# EAGLE design bigPCB (EAGLE 8.5.0)
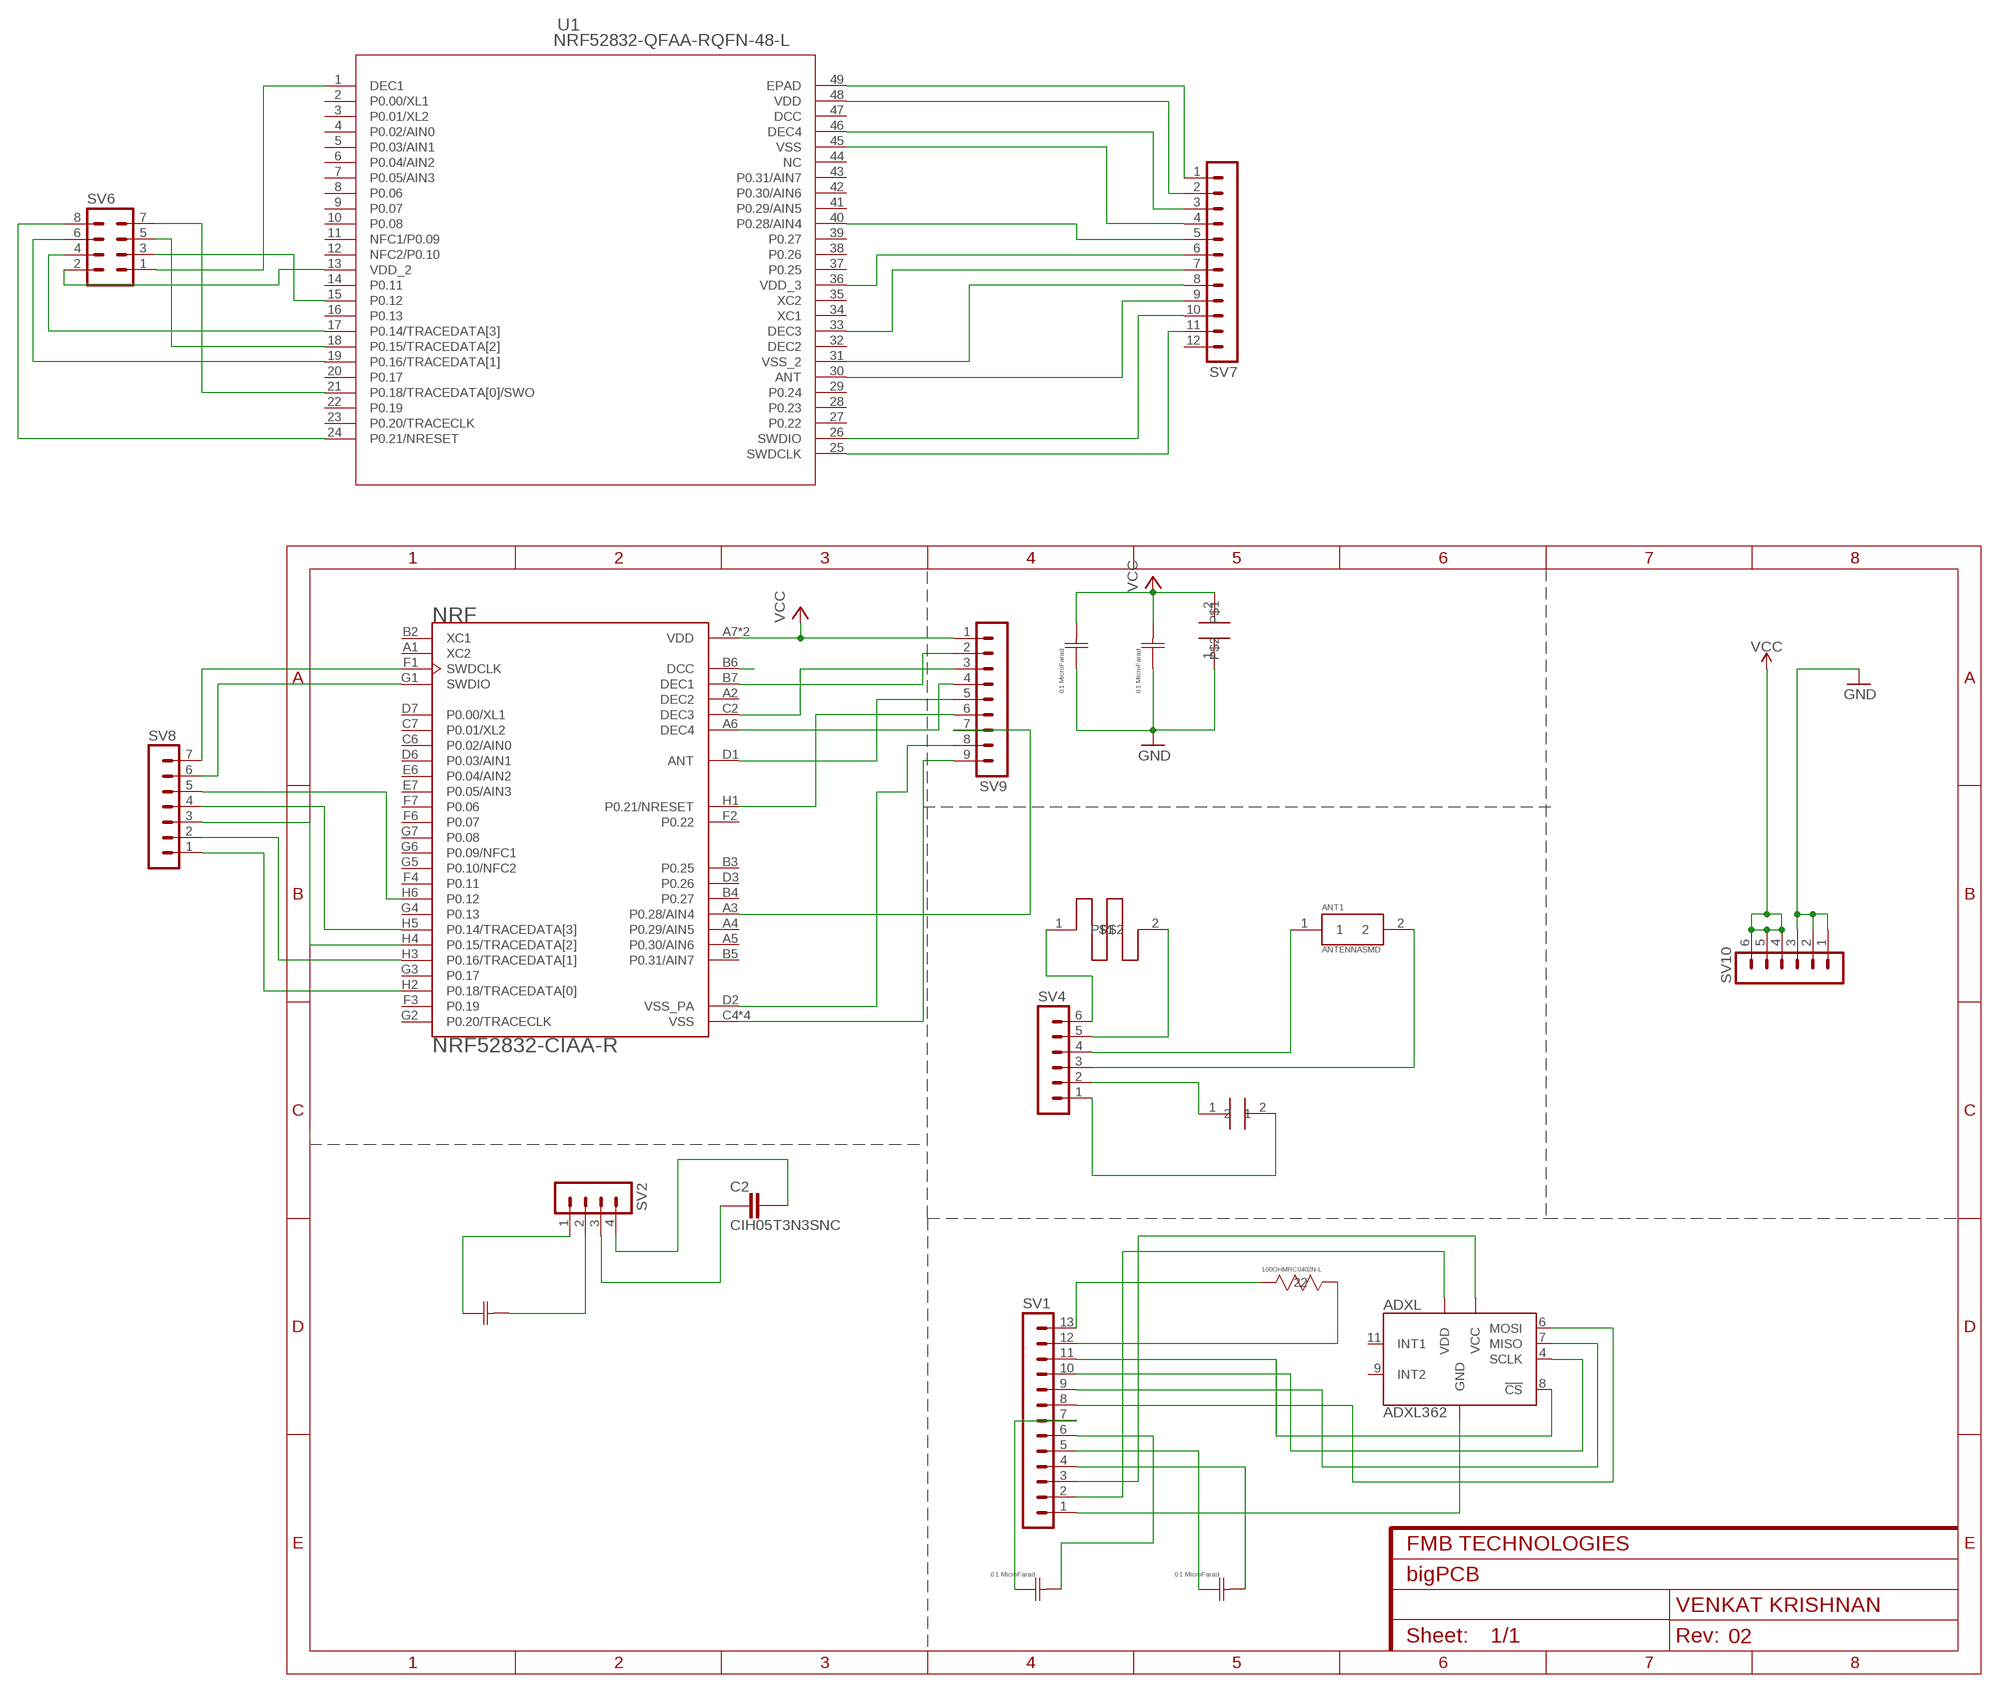
[diagram p0: schematic, sheet 1]

## Parts
ADXL  ADXL362  [TFLGA-16/3.3MMX3.1MM]
ANT1  ANTENNASMD  [1]
C1  GJM1555C1H1R0BB01DG-155-L  [G-155-L]
C2  CIH05T3N3SNC  [CAPC1005X55N]
C6  02016D104KAT2A  [0201]
C7  02016D104KAT2A  [0201]
C8  02016D104KAT2A  [0201]
C9  02016D104KAT2A  [0201]
NRF  NRF52832-CIAA-R  [BGA50N40P7X8_300X320X40]
R6  100OHMRC0402N-L  [RES]
SV1  MA13-1  [MA13-1]
SV2  MA04-1  [MA04-1]
SV4  MA06-1  [MA06-1]
SV6  MA04-2  [MA04-2]
SV7  MA12-1  [MA12-1]
SV8  MA07-1  [MA07-1]
SV9  MA09-1  [MA09-1]
SV10  MA06-1  [MA06-1]
U1  NRF52832-QFAA-RQFN-48-L  [QFN-48-L]
U$1  4.7µF  [CAP]
U$2  0.8PF  [CAP]
U$3  INDUCTOR  [1]

## Nets
GND: C6.1 C7.1 SV10.1 SV10.2 SV10.3 U$1.1
N$1: SV6.1 U1.1(DEC1)
N$2: NRF.B7(DEC1) SV9.2
N$3: R6.1 SV1.13
N$4: R6.2 SV1.12
N$5: SV4.6 U$3.1
N$6: NRF.C2(DEC3) SV9.3
N$7: SV6.3 U1.15(P0.12)
N$8: NRF.A6(DEC4) SV9.4
N$9: NRF.D1(ANT) SV9.5
N$10: ADXL.12(GND) ADXL.13(GND) ADXL.16(GND) SV1.1
N$11: SV6.4 U1.17(P0.14/TRACEDATA[3])
N$12: SV6.5 U1.18(P0.15/TRACEDATA[2])
N$13: SV6.6 U1.19(P0.16/TRACEDATA[1])
N$14: SV6.7 U1.21(P0.18/TRACEDATA[0]/SWO)
N$15: SV6.8 U1.24(P0.21/NRESET)
N$16: SV7.3 U1.46(DEC4)
N$17: SV7.7 U1.33(DEC3)
N$18: NRF.F1(SWDCLK) SV8.7
N$19: NRF.G1(SWDIO) SV8.6
N$20: NRF.H6(P0.12) SV8.5
N$21: NRF.H5(P0.14/TRACEDATA[3]) SV8.4
N$22: NRF.H4(P0.15/TRACEDATA[2]) SV8.3
N$23: NRF.H3(P0.16/TRACEDATA[1]) SV8.2
N$24: NRF.H2(P0.18/TRACEDATA[0]) SV8.1
N$25: SV7.1 U1.49(EPAD)
N$26: NRF.H1(P0.21/NRESET) SV9.6
N$27: SV7.4 U1.45(VSS)
N$28: SV7.5 U1.40(P0.28/AIN4)
N$29: NRF.A3(P0.28/AIN4) SV9.7
N$30: SV7.11 U1.25(SWDCLK)
N$31: SV7.10 U1.26(SWDIO)
N$32: SV7.9 U1.30(ANT)
N$33: SV7.8 U1.31(VSS_2)
N$34: NRF.D2(VSS_PA) SV9.8
N$35: NRF.C4(VSS) NRF.C5(VSS) NRF.E3(VSS) NRF.F5(VSS) SV9.9
N$36: SV4.5 U$3.2
N$37: ANT1.1 SV4.4
N$38: ANT1.2 SV4.3
N$39: SV4.1 U$2.2
N$40: SV4.2 U$2.1
N$41: ADXL.1(VDD) SV1.2
N$42: ADXL.14(VCC) SV1.3
N$43: ADXL.8(!CS) SV1.11
N$44: ADXL.4(SCLK) SV1.10
N$45: ADXL.7(MISO) SV1.9
N$46: ADXL.6(MOSI) SV1.8
N$47: C8.1 SV1.7
N$48: C8.2 SV1.6
N$49: C9.1 SV1.5
N$50: C9.2 SV1.4
N$51: NRF.B6(DCC)
N$61: C1.1 SV2.1
N$62: C1.2 SV2.2
N$63: C2.1 SV2.3
N$64: C2.2 SV2.4
VCC: C6.2 C7.2 NRF.A7(VDD) NRF.H7(VDD) SV6.2 SV7.2 SV7.6 SV9.1 SV10.4 SV10.5 SV10.6 U1.13(VDD_2) U1.36(VDD_3) U1.48(VDD) U$1.2
Unconnected: ADXL.9(INT2) ADXL.11(INT1) NRF.A1(XC2) NRF.A4(P0.29/AIN5) NRF.A5(P0.30/AIN6) NRF.B2(XC1) NRF.B3(P0.25) NRF.B4(P0.27) NRF.B5(P0.31/AIN7) NRF.C6(P0.02/AIN0) NRF.C7(P0.01/XL2) NRF.D3(P0.26) NRF.D6(P0.03/AIN1) NRF.D7(P0.00/XL1) NRF.E6(P0.04/AIN2) NRF.E7(P0.05/AIN3) NRF.F2(P0.22) NRF.F3(P0.19) NRF.F4(P0.11) NRF.F6(P0.07) NRF.F7(P0.06) NRF.G2(P0.20/TRACECLK) NRF.G3(P0.17) NRF.G4(P0.13) NRF.G5(P0.10/NFC2) NRF.G6(P0.09/NFC1) NRF.G7(P0.08) SV7.12 U1.2(P0.00/XL1) U1.3(P0.01/XL2) U1.4(P0.02/AIN0) U1.5(P0.03/AIN1) U1.6(P0.04/AIN2) U1.7(P0.05/AIN3) U1.8(P0.06) U1.9(P0.07) U1.10(P0.08) U1.11(NFC1/P0.09) U1.12(NFC2/P0.10) U1.14(P0.11) U1.16(P0.13) U1.20(P0.17) U1.22(P0.19) U1.23(P0.20/TRACECLK) U1.27(P0.22) U1.28(P0.23) U1.29(P0.24) U1.34(XC1) U1.35(XC2) U1.37(P0.25) U1.38(P0.26) U1.39(P0.27) U1.41(P0.29/AIN5) U1.42(P0.30/AIN6) U1.43(P0.31/AIN7) U1.44(NC)

## Power pins joined to a net without a drawn wire
DCC: U1.47(DCC)
DEC2: NRF.A2(DEC2) U1.32(DEC2)

## Library data of the parts
ADXL = ADXL362:ADXL362: IC ACCEL DIG LO PWR 3AX 16LGA; AVAILABILITY: Good; DESCRIPTION: Accelerometer Triple ±2/±4/±8g 1.6V to 3.6V 16-Pin LGA T/R; MF: Analog Devices; MP: ADXL362BCCZ-RL7; PACKAGE: LGA-16 Analog Devices; PRICE: 6.52 USD
ANT1 = antenna:ANTENNA; AVAILABILITY: Good; DESCRIPTION: Bluetooth/WLAN/WiFi Ceramic Chip Antenna 3-Pin SMD; MF: Pulse; MP: W3008; PACKAGE: None; PRICE: 0.93 USD
C1 = 1pfcap:GJM1555C1H1R0BB01D; MANUFACTURER_PART_NUMBER: GJM1555C1H1R0BB01D; VENDOR: Murata
C2 = 3.3nh_inductor:CIH05T3N3SNC: FIXED IND 3.3NH 300MA 190 MOHM; AVAILABILITY: Good; DESCRIPTION: Ind High Frequency Chip Multi-Layer 3.3nH 0.3nH 100MHz 8Q-Factor Ceramic 300mA 0402 Paper T/R; MF: Samsung; MP: CIH05T3N3SNC; PACKAGE: 0402 Samsung; PRICE: 0.01 USD
C6-C9 = cap_1microfarad:02016D104KAT2A; MANUFACTURER_PART_NUMBER: 02016D104KAT2A; VENDOR: AVX Corporation
NRF = NRF52832-CIAA-R:NRF52832-CIAA-R: Multi Protocal Bluetooth Smart ANT 2.4GHz RF SoC (WL-CSP); AVAILABILITY: Good; DESCRIPTION: Multi Protocal Bluetooth Smart ANT 2.4GHz RF SoC (WL-CSP); MF: Nordic; MP: NRF52832-CIAA-R; PACKAGE: XFBGA-50 Nordic Semiconductor; PRICE: 3.75 USD
R6 = 100ohm:100OHM; MANUFACTURER_PART_NUMBER: RC0402FR07100RL; VENDOR: Yageo
SV1 = con-lstb:MA13-1: PIN HEADER; OC_FARNELL: unknown; OC_NEWARK: unknown
SV2 = con-lstb:MA04-1: PIN HEADER; OC_FARNELL: unknown; OC_NEWARK: unknown
SV4 SV10 = con-lstb:MA06-1: PIN HEADER; OC_FARNELL: unknown; OC_NEWARK: unknown
SV6 = con-lstb:MA04-2: PIN HEADER; OC_FARNELL: unknown; OC_NEWARK: unknown
SV7 = con-lstb:MA12-1: PIN HEADER; OC_FARNELL: unknown; OC_NEWARK: unknown
SV8 = con-lstb:MA07-1: PIN HEADER; OC_FARNELL: unknown; OC_NEWARK: unknown
SV9 = con-lstb:MA09-1: PIN HEADER; OC_FARNELL: unknown; OC_NEWARK: unknown
U1 = NRF52832_QFN:NRF52832-QFAA-R; MANUFACTURER_PART_NUMBER: NRF52832QFAAR; VENDOR: Nordic Semiconductor
U$1 = 4p7microfarad:4.7µF
U$2 = 0p8picofarad:0.8PF
U$3 = inductor:INDUCTOR

## Board
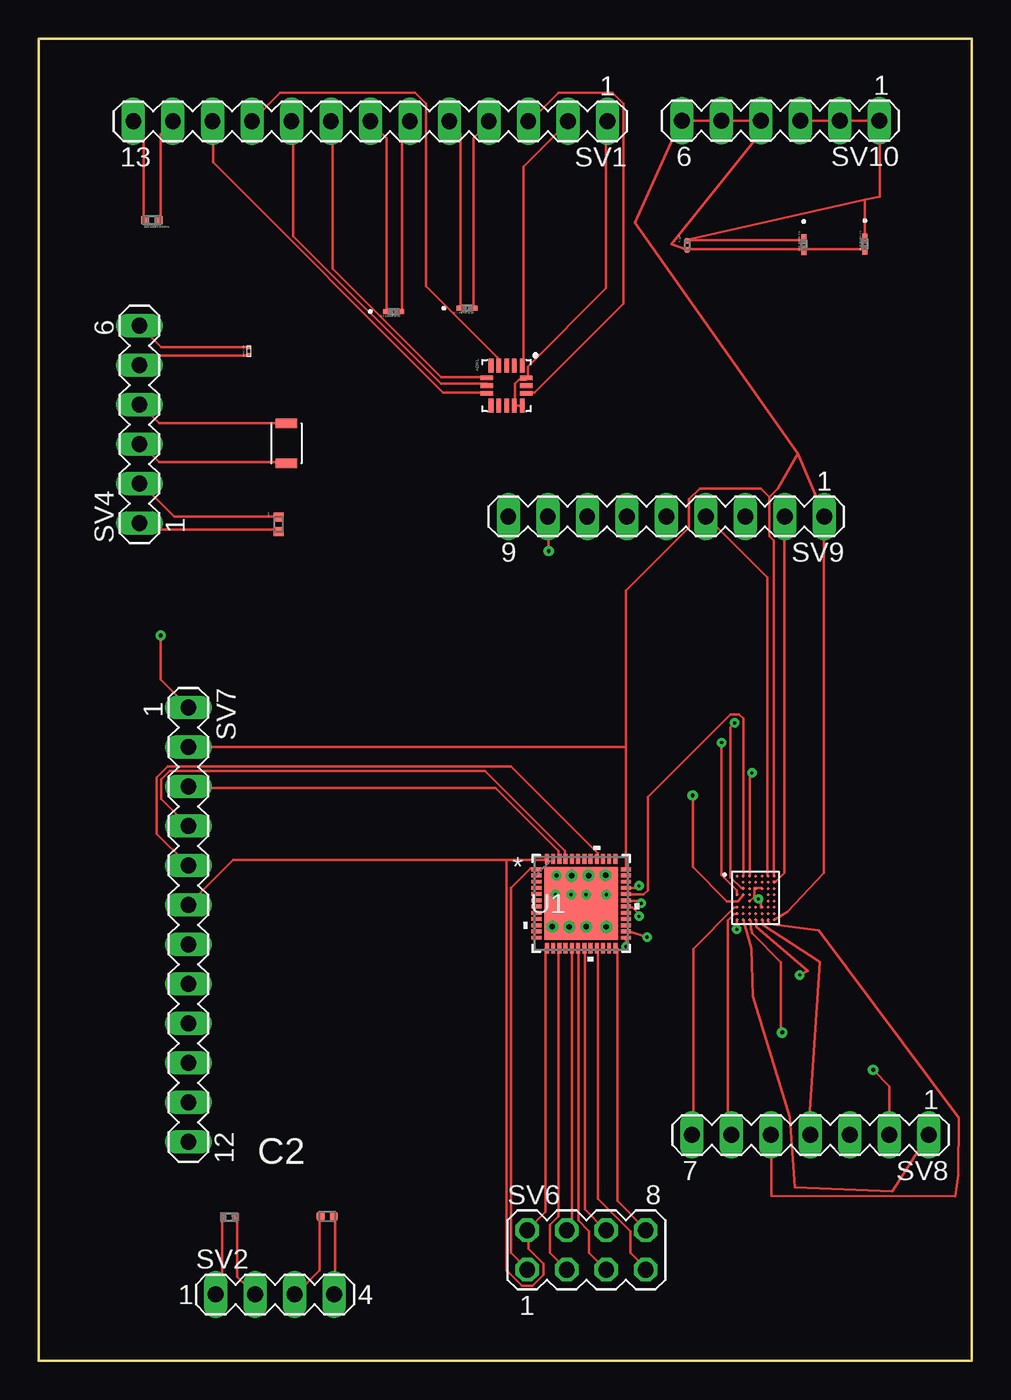
[diagram p1: board, top side]
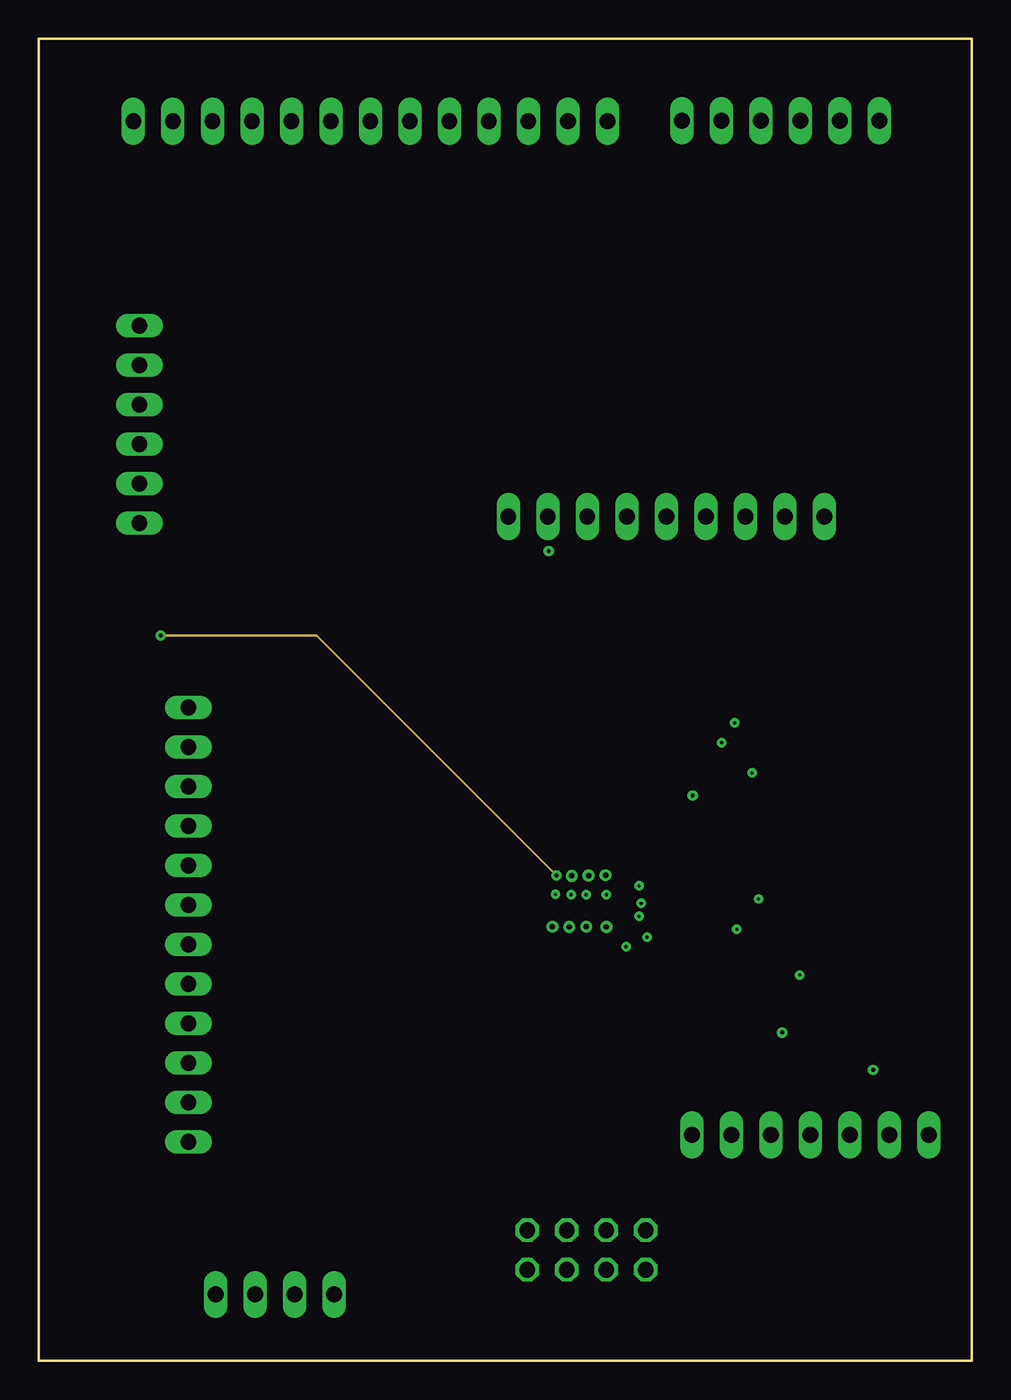
[diagram p2: board, inner layer Route4]
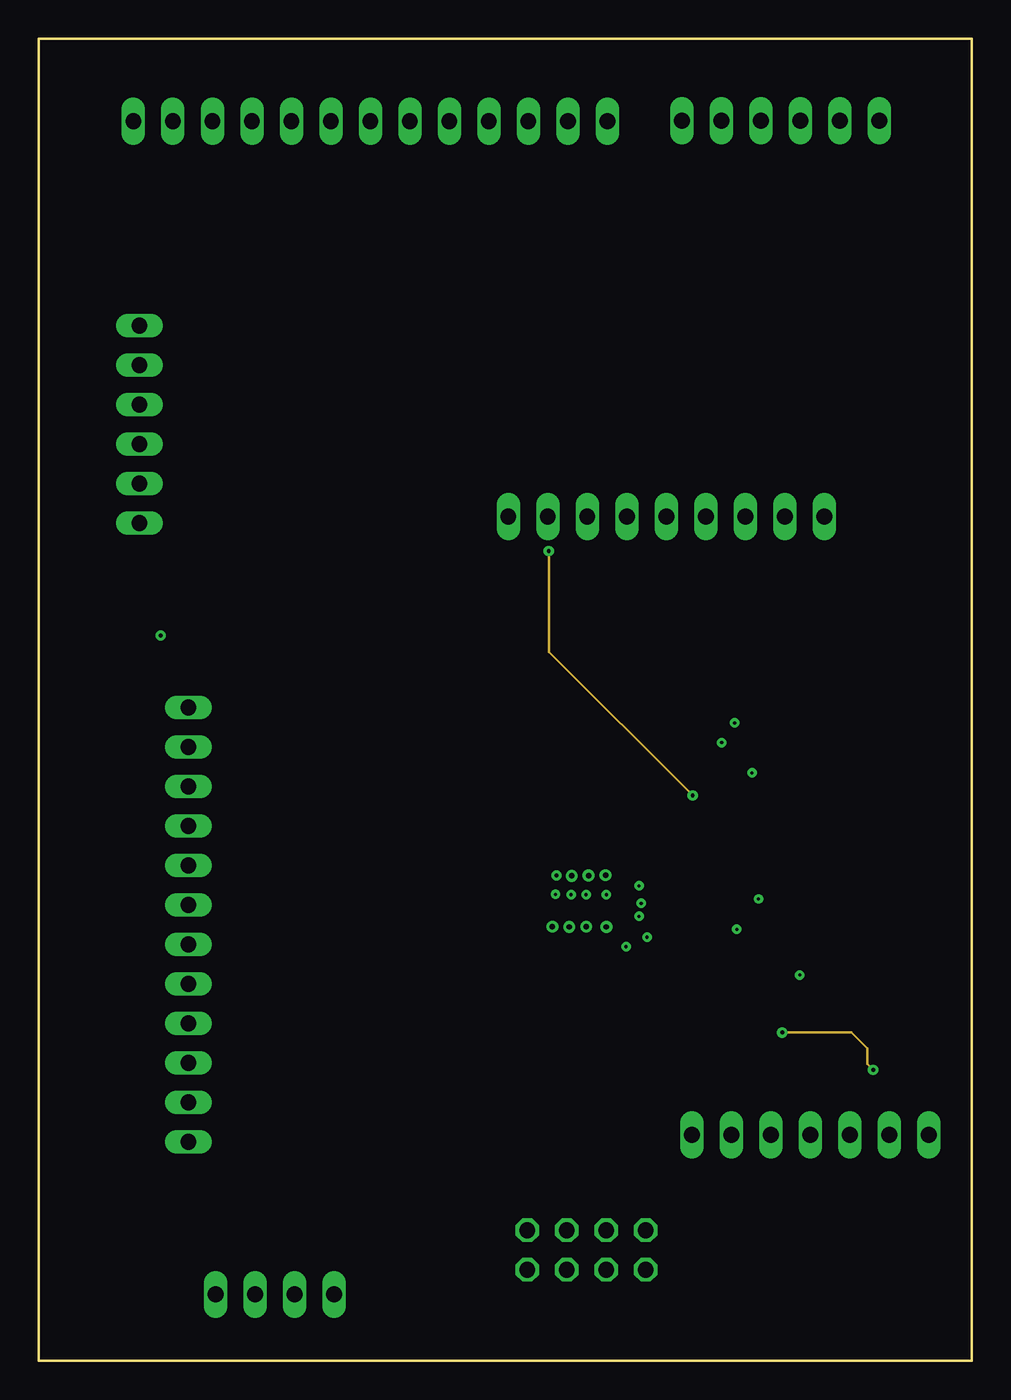
[diagram p3: board, inner layer Route12]
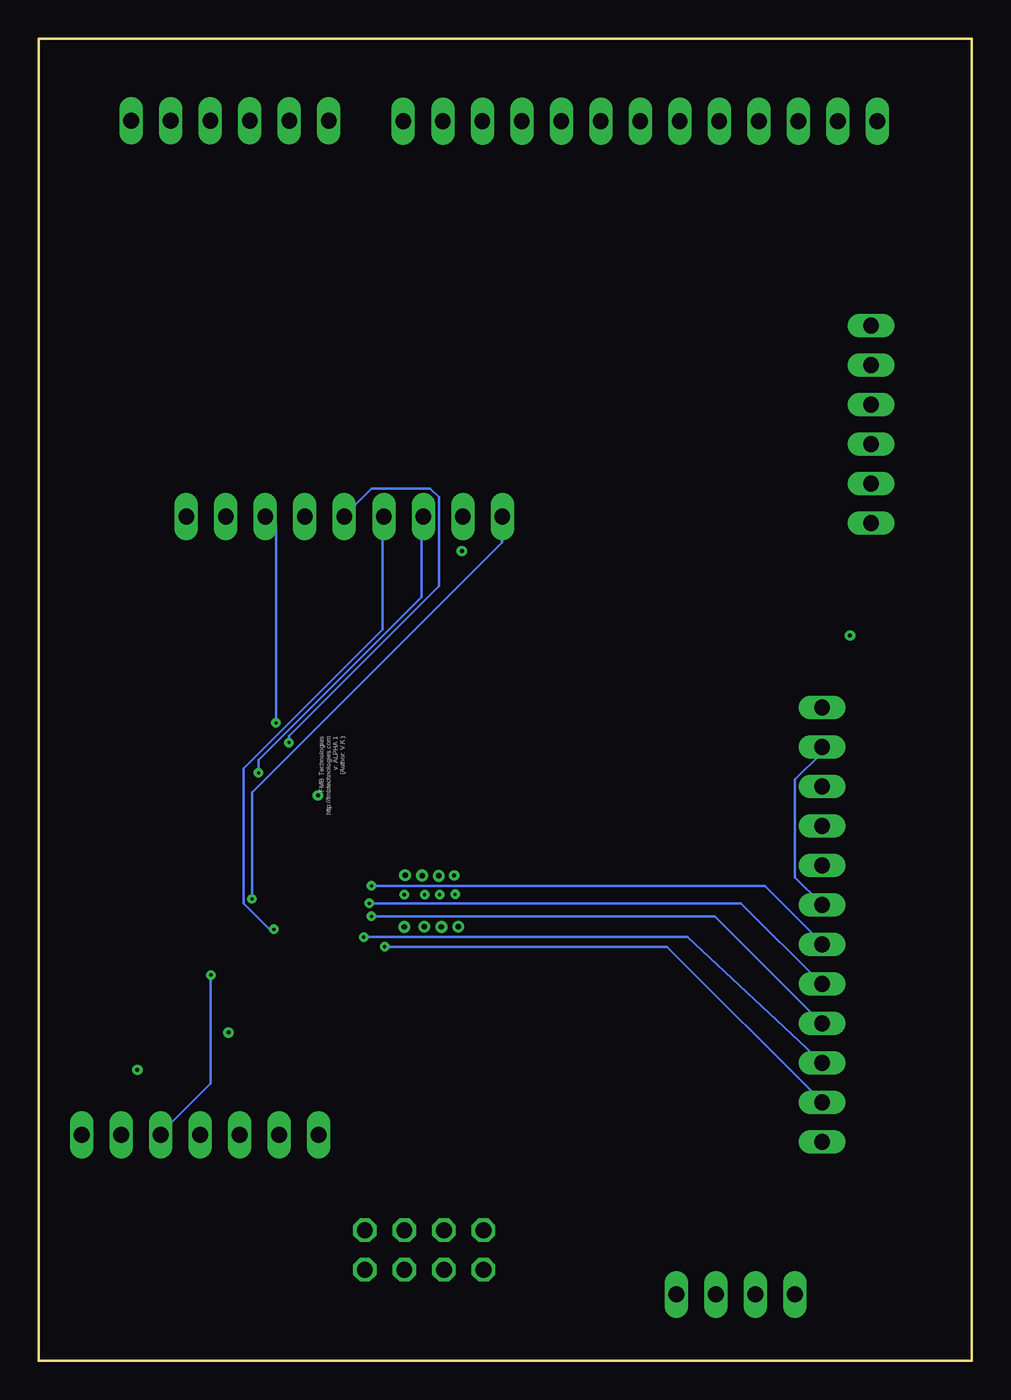
[diagram p4: board, bottom side, seen from below]

Size 60 x 85 mm. Coordinates in mm from the lower left corner, seen from the top.
Outline: 0,85 60,85 60,0 0,0 0,85
Copper layers ((1*4)*(12*16)): Top 0.035mm / dielectric 1.15mm / Route4 0.035mm / dielectric 0.15mm / Route12 0.035mm / dielectric 0.2mm / Bottom 0.035mm
Design rules "default *": minimum track width 6mil, minimum drill 8mil, track to track 5mil, track to pad 5mil, pad to pad 5mil, via to via 5mil, smd to smd 2mil, copper to edge 20mil, drill to drill 20mil, minimum pad ring 10mil, minimum via ring 8mil, stop-mask expansion 4mil, vias tented up to drill 0mil, thermal gap 10mil

### Footprints (pad centres in the part's own frame; a part is rotated, then mirrored left to right if it is on the bottom)
TFLGA-16/3.3MMX3.1MM = smd 0.925 x 0.3: 1 -1.288,1; 2 -1.288,0.5; 3 -1.288,0; 4 -1.288,-0.5; 5 -1.288,-1; 9 1.288,-1; 10 1.288,-0.5; 11 1.288,0; 12 1.288,0.5; 13 1.288,1 | smd 0.3 x 0.8: 6 -0.5,-1.275; 7 0,-1.275; 8 0.5,-1.275; 14 0.5,1.275; 15 0,1.275; 16 -0.5,1.275
1 = smd 0.62 x 1.36: 1 0,0; 2 2.58,0
G-155-L = smd 0.356 x 0.508: 1 -0.419,0; 2 0.419,0
CAPC1005X55N = smd 0.54 x 0.6: 1 -0.43,0; 2 0.43,0
0201 = smd 0.559 x 0.305: 1 -0.394,0; 2 0.394,0
BGA50N40P7X8_300X320X40 = smd 0.2 x 0.2: A1 -1.2,1.4; A2 -0.8,1.4; A3 -0.4,1.4; A4 0,1.4; A5 0.4,1.4; A6 0.8,1.4; A7 1.2,1.4; B2 -0.8,1; B3 -0.4,1; B4 0,1; B5 0.4,1; B6 0.8,1; B7 1.2,1; C2 -0.8,0.6; C3 -0.4,0.6; C4 0,0.6; C5 0.4,0.6; C6 0.8,0.6; C7 1.2,0.6; D1 -1.2,0.2; D2 -0.8,0.2; D3 -0.4,0.2; D6 0.8,0.2; D7 1.2,0.2; E3 -0.4,-0.2; E6 0.8,-0.2; E7 1.2,-0.2; F1 -1.2,-0.6; F2 -0.8,-0.6; F3 -0.4,-0.6; F4 0,-0.6; F5 0.4,-0.6; F6 0.8,-0.6; F7 1.2,-0.6; G1 -1.2,-1; G2 -0.8,-1; G3 -0.4,-1; G4 0,-1; G5 0.4,-1; G6 0.8,-1; G7 1.2,-1; H1 -1.2,-1.4; H2 -0.8,-1.4; H3 -0.4,-1.4; H4 0,-1.4; H5 0.4,-1.4; H6 0.8,-1.4; H7 1.2,-1.4
RES = smd 0.457 x 0.508: 1 -0.457,0; 2 0.457,0
MA13-1 = drill 1.016 long: 1 -15.24,0; 2 -12.7,0; 3 -10.16,0; 4 -7.62,0; 5 -5.08,0; 6 -2.54,0; 7 0,0; 8 2.54,0; 9 5.08,0; 10 7.62,0; 11 10.16,0; 12 12.7,0; 13 15.24,0
MA04-1 = drill 1.016 long: 1 -3.81,0; 2 -1.27,0; 3 1.27,0; 4 3.81,0
MA06-1 = drill 1.016 long: 1 -6.35,0; 2 -3.81,0; 3 -1.27,0; 4 1.27,0; 5 3.81,0; 6 6.35,0
MA04-2 = drill 1.016 octagon: 1 -3.81,-1.27; 2 -3.81,1.27; 3 -1.27,-1.27; 4 -1.27,1.27; 5 1.27,-1.27; 6 1.27,1.27; 7 3.81,-1.27; 8 3.81,1.27
MA12-1 = drill 1.016 long: 1 -13.97,0; 2 -11.43,0; 3 -8.89,0; 4 -6.35,0; 5 -3.81,0; 6 -1.27,0; 7 1.27,0; 8 3.81,0; 9 6.35,0; 10 8.89,0; 11 11.43,0; 12 13.97,0
MA07-1 = drill 1.016 long: 1 -7.62,0; 2 -5.08,0; 3 -2.54,0; 4 0,0; 5 2.54,0; 6 5.08,0; 7 7.62,0
MA09-1 = drill 1.016 long: 1 -10.16,0; 2 -7.62,0; 3 -5.08,0; 4 -2.54,0; 5 0,0; 6 2.54,0; 7 5.08,0; 8 7.62,0; 9 10.16,0
QFN-48-L = smd 0.66 x 0.254: 1 -2.87,2.2; 2 -2.87,1.8; 3 -2.87,1.4; 4 -2.87,1; 5 -2.87,0.6; 6 -2.87,0.2; 7 -2.87,-0.2; 8 -2.87,-0.6; 9 -2.87,-1; 10 -2.87,-1.4; 11 -2.87,-1.8; 12 -2.87,-2.2; 25 2.87,-2.2; 26 2.87,-1.8; 27 2.87,-1.4; 28 2.87,-1; 29 2.87,-0.6; 30 2.87,-0.2; 31 2.87,0.2; 32 2.87,0.6; 33 2.87,1; 34 2.87,1.4; 35 2.87,1.8; 36 2.87,2.2 | smd 0.254 x 0.66: 13 -2.2,-2.87; 14 -1.8,-2.87; 15 -1.4,-2.87; 16 -1,-2.87; 17 -0.6,-2.87; 18 -0.2,-2.87; 19 0.2,-2.87; 20 0.6,-2.87; 21 1,-2.87; 22 1.4,-2.87; 23 1.8,-2.87; 24 2.2,-2.87; 37 2.2,2.87; 38 1.8,2.87; 39 1.4,2.87; 40 1,2.87; 41 0.6,2.87; 42 0.2,2.87; 43 -0.2,2.87; 44 -0.6,2.87; 45 -1,2.87; 46 -1.4,2.87; 47 -1.8,2.87; 48 -2.2,2.87 | smd 4.699 x 4.699: 49 0,0
CAP = smd 0.34 x 0.36: 1 -0.28,0; 2 0.28,0
CAP' = smd 0.58 x 0.62: 1 -0.47,0; 2 0.47,0
1' = smd 0.23 x 0.3: 1 -0.235,0; 2 0.235,0

### Placement (x,y rotation side)
ADXL  30.08,62.7 270 top
ANT1  15.92,60.28 270 top
C1  12.24,9.23 0 top
C2  18.54,9.28 0 top
C6  49.2,71.76 270 top
C7  53.13,71.81 270 top
C8  22.82,67.47 0 top
C9  27.55,67.68 0 top
NRF  46.1,29.76 0 top
R6  7.27,73.33 0 top
SV1  21.32,79.7 180 top
SV2  15.18,4.26 0 top
SV4  6.47,60.21 90 top
SV6  35.22,7.12 0 top
SV7  9.62,28.03 270 top
SV8  49.63,14.51 180 top
SV9  40.35,54.28 180 top
SV10  47.7,79.74 180 top
U1  34.88,29.4 0 top
U$1  41.69,71.72 270 top
U$2  0.8PF  [CAP']  15.42,53.77 270 top
U$3  INDUCTOR  [1']  13.5,64.91 270 top

### Tracks (layer width: path | path; a pad name or v marks a point on that pad's centre or on a via)
DEC2
  Top 0.152: NRF.A2 45.31,31.23 45.31,41.29 45.03,41.57 44.47,41.57 39.16,36.26 39.16,30.25 38.88,29.97 37.77,29.97 U1.32
GND
  Top 0.152: SV10.3 SV10.2 SV10.1 54.08,79.61 54.08,74.86 53.14,74.65 | C6.1 49.13,72.05 41.73,72.05 U$1.1 41.59,72.05 53.14,74.65 | C7.1 53.13,72.3 53.13,74.67 53.14,74.65
N$1
  Top 0.152: U1.1 31.9,31.65 31.62,31.65 30.36,30.39 30.36,6.92 31.34,5.94 SV6.1
N$2
  Top 0.152: NRF.B7 47.26,30.81 47.4,30.81 47.96,31.37 SV9.2
N$3
  Top 0.152: R6.1 6.73,73.43 6.73,79.02 6.17,79.58 SV1.13
N$4
  Top 0.152: R6.2 7.84,73.43 7.84,78.88 8.54,79.58 SV1.12
N$5
  Top 0.152: U$3.1 13.46,65.17 7.87,65.17 6.61,66.43 SV4.6
N$6  (via drill 0.2)
  Top 0.152: v44.75,41.01 44.47,40.73 44.47,31.09 45.17,30.39 45.31,30.39 NRF.C2
  Bottom 0.152: v44.75,41.01 44.75,53.72 45.31,54.28 SV9.3
N$7
  Top 0.152: U1.15 33.43,26.48 33.43,9.3 32.88,8.74 32.88,6.92 33.85,5.94 SV6.3
N$8
  Top 0.152: NRF.A6 46.84,31.23 46.84,50.37 42.93,54.28 SV9.4
N$9  (via drill 0.2)
  Top 0.152: v43.91,39.75 43.91,31.23 44.89,30.25 NRF.D1
  Bottom 0.152: v43.91,39.75 43.91,40.17 34.27,49.81 34.27,55.54 34.83,56.09 38.6,56.09 40.28,54.42 SV9.5
N$10
  Top 0.152: 30.62,61.42 30.62,62.81 30.9,63.09 31.31,63.09 ADXL.16 31.45,63.23 31.45,63.93 36.48,68.96 36.48,79.58 SV1.1 | 30.62,61.42 31.04,61.42 ADXL.13 | 30.62,61.42 ADXL.12
N$11
  Top 0.152: U1.17 34.27,26.48 34.27,8.74 33.99,8.46 SV6.4
N$12
  Top 0.152: U1.18 34.69,26.48 34.69,9.02 35.39,8.32 35.39,6.92 36.37,5.94 SV6.5
N$13
  Top 0.152: U1.19 35.11,26.48 35.11,9.71 36.37,8.46 SV6.6
N$14
  Top 0.152: U1.21 35.95,26.48 35.95,10.41 38.04,8.32 38.04,6.92 39.02,5.94 SV6.7
N$15
  Top 0.152: U1.24 37.21,26.48 37.21,10.27 39.02,8.46 SV6.8
N$16
  Top 0.152: U1.46 33.43,32.35 33.43,32.77 29.38,36.82 9.68,36.82 SV7.3
N$17  (via drill 0.2)
  Top 0.152: v38.6,30.53 38.46,30.39 37.77,30.39 U1.33
  Bottom 0.152: v38.6,30.53 13.32,30.53 9.68,26.9 SV7.7
N$18
  Top 0.152: NRF.F1 44.89,29.13 44.75,29.13 42.09,26.48 42.09,14.6 SV8.7
N$19
  Top 0.152: NRF.G1 44.89,28.71 44.75,28.71 44.33,28.29 44.33,14.74 44.47,14.6 SV8.6
N$20
  Top 0.152: NRF.H6 46.9,28.32 46.98,28.09 50.18,27.67 59.17,15.63 59.13,11.95 58.95,10.55 47.12,10.6 47.12,14.46 SV8.5
N$21
  Top 0.152: NRF.H5 46.57,28.29 46.57,28.02 50.23,25.65 49.5,14.6 SV8.4
N$22  (via drill 0.2)
  Top 0.152: v48.94,24.8 49.46,25.06 46.15,27.88 46.15,28.29 NRF.H4
  Bottom 0.152: v48.94,24.8 48.94,17.82 52.15,14.6 SV8.3
N$23  (via drill 0.25)
  Top 0.152: NRF.H3 45.79,28.27 45.79,27.8 45.89,27.46 47.74,25.61 47.74,21.17 v47.81,21.1 | v53.66,18.69 54.7,17.65 SV8.2
  Route12 0.152: v47.81,21.1 52.25,21.1 53.27,20.08 53.27,19.08 v53.66,18.69
N$24
  Top 0.152: NRF.H2 45.83,26.51 45.94,23.42 48.29,15.66 48.63,11.14 54.91,10.89 57.18,14.46 SV8.1
N$25  (via drill 0.25)
  Top 0.152: U1.49 33.29,30.99 v33.29,31.2 | v7.83,46.63 7.83,43.79 SV7.1
  Route4 0.152: v33.29,31.2 17.86,46.63 v7.83,46.63
N$26  (via drill 0.2)
  Top 0.152: v44.89,27.74 44.89,28.29 NRF.H1
  Bottom 0.152: v44.89,27.74 45.17,27.74 46.84,29.41 46.84,38.07 37.91,47.01 37.91,54.28 SV9.6
N$27
  Top 0.152: U1.45 33.85,32.35 33.85,32.77 28.68,37.93 8.43,37.93 7.87,37.38 7.87,36.12 9.55,34.44 SV7.4
N$28
  Top 0.152: U1.40 35.95,32.35 35.95,32.62 30.36,38.21 8.29,38.21 7.59,37.52 7.59,33.88 9.55,31.93 SV7.5
N$29  (via drill 0.2)
  Top 0.152: v45.87,37.79 45.73,37.65 45.73,31.23 NRF.A3
  Bottom 0.152: v45.87,37.79 45.87,38.63 35.39,49.11 35.39,54.28 SV9.7
N$30  (via drill 0.2)
  Top 0.152: v37.77,26.62 37.77,27.18 U1.25
  Bottom 0.152: v37.77,26.62 19.6,26.62 9.68,16.7 SV7.11
N$31  (via drill 0.2)
  Top 0.152: v39.11,27.23 38.05,27.57 U1.26
  Bottom 0.152: v39.11,27.23 18.29,27.26 9.68,19.21 SV7.10
N$32  (via drill 0.2)
  Top 0.152: v38.6,28.57 38.6,28.71 38.18,29.13 37.77,29.13 U1.30
  Bottom 0.152: v38.6,28.57 16.53,28.57 9.68,21.73 SV7.9
N$33  (via drill 0.2)
  Top 0.152: v38.74,29.41 38.6,29.55 37.77,29.55 U1.31
  Bottom 0.152: v38.74,29.41 14.85,29.41 9.68,24.24 SV7.8
N$34  (via drill 0.25, 0.25 pad 0.13)
  Top 0.152: NRF.D2 44.95,29.53 44.27,29.53 42.05,31.75 v42.05,36.35 | v32.79,52.07 32.79,54.23 SV9.8
  Route12 0.152: v42.05,36.35 32.82,45.58 32.82,52.04 v32.79,52.07
N$35  (via drill 0.2)
  Top 0.152: 46.01,29.83 45.73,29.55 NRF.E3 | 46.01,29.83 46.01,30.39 NRF.C4 46.15,30.39 46.43,30.39 NRF.C5 | 46.01,29.83 46.15,29.69 | 46.15,29.69 46.43,29.41 46.43,29.13 NRF.F5 | v46.29,29.69 46.15,29.69
  Bottom 0.152: v46.29,29.69 46.29,36.54 30.22,52.6 30.22,54.28 SV9.9
N$36
  Top 0.152: U$3.2 13.46,64.62 7.17,64.62 6.61,64.06 SV4.5
N$37
  Top 0.152: ANT1.1 15.83,60.29 7.73,60.29 6.61,61.4 SV4.4
N$38
  Top 0.152: ANT1.2 15.83,57.77 7.73,57.77 6.61,58.89 SV4.3
N$39
  Top 0.152: U$2.2 15.41,53.44 6.89,53.44 6.61,53.72 SV4.1
N$40
  Top 0.152: U$2.1 15.41,54.28 8.71,54.28 6.61,56.37 SV4.2
N$41
  Top 0.152: ADXL.1 31.18,64.07 31.18,76.78 33.97,79.58 SV1.2
N$42
  Top 0.152: ADXL.14 31.45,62.26 31.87,62.26 37.6,67.98 37.6,80.84 36.9,81.53 33.41,81.53 31.59,79.72 SV1.3
N$43
  Top 0.152: ADXL.8 28.8,62.26 26.01,62.26 11.2,77.06 11.2,79.58 SV1.11
N$44
  Top 0.152: ADXL.4 29.5,64.07 29.5,64.49 24.89,69.1 24.89,80.84 24.19,81.53 15.53,81.53 13.71,79.72 SV1.10
N$45
  Top 0.152: ADXL.7 28.8,62.81 25.87,62.81 16.37,72.31 16.37,79.58 SV1.9
N$46
  Top 0.152: ADXL.6 28.8,63.23 25.87,63.23 18.88,70.22 18.88,79.58 SV1.8
N$47
  Top 0.152: C8.1 22.37,67.56 22.37,78.6 21.4,79.58 SV1.7
N$48
  Top 0.152: C8.2 23.35,67.56 23.35,79.16 23.77,79.58 SV1.6
N$49
  Top 0.152: C9.1 27.12,67.7 27.12,78.88 26.43,79.58 SV1.5
N$50
  Top 0.152: C9.2 27.96,67.7 27.96,78.6 28.94,79.58 SV1.4
N$52  (via drill 0.35)
  other vias: 34.28,31.17
N$53  (via drill 0.35)
  other vias: 35.35,31.2
N$54  (via drill 0.35)
  other vias: 36.44,31.22
N$55  (via drill 0.35)
  other vias: 33.03,27.91
N$56  (via drill 0.35)
  other vias: 34.1,27.89
N$57  (via drill 0.35)
  other vias: 35.21,27.91
N$58  (via drill 0.35)
  other vias: 36.5,27.89
N$59  (via drill 0.2)
  other vias: 36.5,29.97
N$60  (via drill 0.2)
  other vias: 35.19,29.96
N$61
  Top 0.152: C1.1 11.78,9.16 11.78,4.55 11.5,4.27 SV2.1
N$62
  Top 0.152: C1.2 12.76,9.16 12.76,5.38 13.88,4.27 SV2.2
N$63
  Top 0.152: C2.1 18.07,9.16 18.07,5.8 16.53,4.27 SV2.3
N$64
  Top 0.152: C2.2 19.05,9.16 19.05,4.27 SV2.4
N$65  (via drill 0.2)
  other vias: 34.23,29.96
N$66  (via drill 0.2)
  other vias: 33.23,29.98
VCC
  Top 0.152: U1.13 32.6,26.48 32.6,9.57 31.48,8.46 SV6.2 31.48,8.32 31.48,7.2 32.46,6.22 32.46,5.52 31.76,4.82 31.06,4.82 30.08,5.8 30.08,32.21 | 30.08,32.21 12.48,32.21 9.68,29.41 SV7.6 | 30.08,32.21 32.6,32.21 U1.48 | NRF.H7 47.32,28.37 48.13,28.87 50.48,31.37 50.48,54.28 SV9.1 50.48,54.42 48.83,58.32 | 46.98,55.54 46.98,53.02 47.26,52.74 47.26,31.23 NRF.A7 | 46.98,55.54 47.54,56.09 48.83,58.32 | 37.77,39.47 37.77,49.53 41.82,53.58 41.82,55.4 42.52,56.09 46.43,56.09 46.98,55.54 | 37.77,39.47 37.77,31.65 U1.36 | 48.83,58.32 38.32,73.19 41.23,79.61 SV10.6 SV10.5 SV10.4 46.53,79.61 46.95,79.61 40.68,71.81 41.59,71.49 U$1.2 41.73,71.49 49.13,71.49 C6.2 49.22,71.46 52.99,71.46 C7.2 | 37.77,39.47 9.68,39.47 SV7.2
  Bottom 0.152: SV7.2 9.68,39.33 9.68,39.05 11.36,37.38 11.36,31.09 9.68,29.41 SV7.6

### Text on the board
bNames: FMB Technologies / http://fmbtechnologies.com / v: ALPHA 1 / (Author: V.K.)